# Altium schematic sheet Microcontroller System.SchDoc
size A
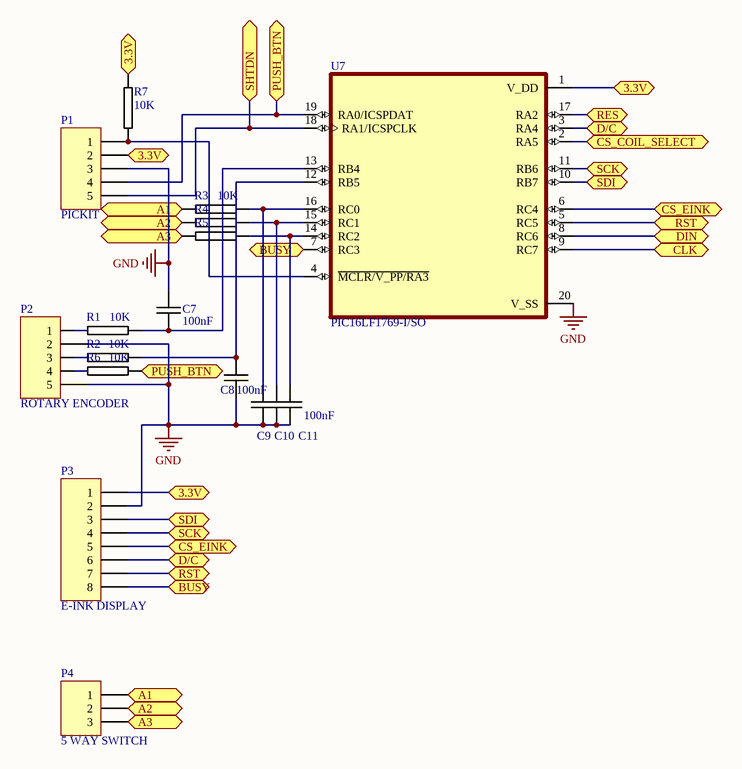
[diagram p0: Microcontroller System.SchDoc]

## Parts
C7  100nF  [0805C-TBD]
C8  100nF  [0805C-TBD]
C9  100nF  [0805C-TBD]  (value not drawn)
C10  100nF  [0805C-TBD]  (value not drawn)
C11  100nF  [0805C-TBD]
P1  PICKIT  [HDR1X5]
P2  ROTARY ENCODER  [HDR1X5]
P3  E-INK DISPLAY  [HDR1X8]
P4  5 WAY SWITCH  [HDR1X3]
R1  10K  [0805R-10K]
R2  10K  [0805R-10K]
R3  10K  [0805R-10K]
R4  10K  [0805R-10K]  (value not drawn)
R5  10K  [0805R-10K]  (value not drawn)
R6  10K  [0805R-10K]
R7  10K  [0805R-10K]
U7  PIC16LF1769-I/SO  [SOIC127P1032X265-20N]

## Ports
3.3V, A1, A2, A3, BUSY, CLK, CS_COIL_SELECT, CS_EINK, D/C, DIN, PUSH_BTN, RES, RST, SCK, SDI, SHTDN

## Nets
GND: C7.1 C8.2 C9.2 C10.2 C11.2 P1.3 P2.2 P2.5 P3.2 U7.20(V_SS)
3.3V: P1.2 P3.1 R7.2 U7.1(V_DD) ; port 3.3V
A1: P4.1 R3.1 ; port A1
A2: P4.2 R4.1 ; port A2
A3: P4.3 R5.1 ; port A3
BUSY: P3.8 U7.7(RC3) ; port BUSY
CLK: U7.9(RC7) ; port CLK
CS_COIL_SELECT: U7.2(RA5) ; port CS_COIL_SELECT
CS_EINK: P3.5 U7.6(RC4) ; port CS_EINK
D/C: P3.6 U7.3(RA4) ; port D/C
DIN: U7.8(RC6) ; port DIN
PUSH_BTN: P1.4 R6.2 U7.19(RA0/ICSPDAT) ; port PUSH_BTN
RES: U7.17(RA2) ; port RES
RST: P3.7 U7.5(RC5) ; port RST
SCK: P3.4 U7.11(RB6) ; port SCK
SDI: P3.3 U7.10(RB7) ; port SDI
SHTDN: P1.5 U7.18(RA1/ICSPCLK) ; port SHTDN
NetC7_2: C7.2 R1.2 U7.13(RB4)
NetC8_1: C8.1 R2.2 U7.12(RB5)
NetC9_1: C9.1 R3.2 U7.16(RC0)
NetC10_1: C10.1 R4.2 U7.15(RC1)
NetC11_1: C11.1 R5.2 U7.14(RC2)
NetP1_1: P1.1 R7.1 U7.4(~{MCLR/V_PP/RA3})
NetP2_1: P2.1 R1.1
NetP2_3: P2.3 R2.1
NetP2_4: P2.4 R6.1

## Library data of the parts
C7-C11 = 0805C-100nF-25V-X7R-MUR: CAPACITOR 0805 CERAMIC; Supplier 1: Digi-Key; Supplier Part Number 1: 490-1673-1-ND
P1 P2 = Header 5: Header, 5-Pin; LatestRevisionDate: 17-Jul-2002; LatestRevisionNote: Re-released for DXP Platform.; Publisher: Altium Limited
P3 = Header 8: Header, 8-Pin; LatestRevisionDate: 17-Jul-2002; LatestRevisionNote: Re-released for DXP Platform.; Publisher: Altium Limited
P4 = Header 3: Header, 3-Pin; LatestRevisionDate: 17-Jul-2002; LatestRevisionNote: Re-released for DXP Platform.; Publisher: Altium Limited
R1-R7 = 0805R-10K: RESISTOR 0805 1/4 WATT THIN FILM; Reel: *
U7 = PIC16LF1769-I/SO: PIC PICÂ® XLPâ„¢ 16F Microcontroller IC 8-Bit 32MHz 14KB (8K x 14) FLASH 20-SOIC; MF: Microchip; Price: None; Purchase-URL: https://pricing.snapeda.com/search/part/PIC16LF1769-I/SO/?ref=eda; Value: *; Package: SOIC-20 Microchip; SnapEDA_Link: https://www.snapeda.com/parts/PIC16LF1769-I/SO/Microchip/view-part/880488/?ref=snap; Availability: Warning; MP: PIC16LF1769-I/SO